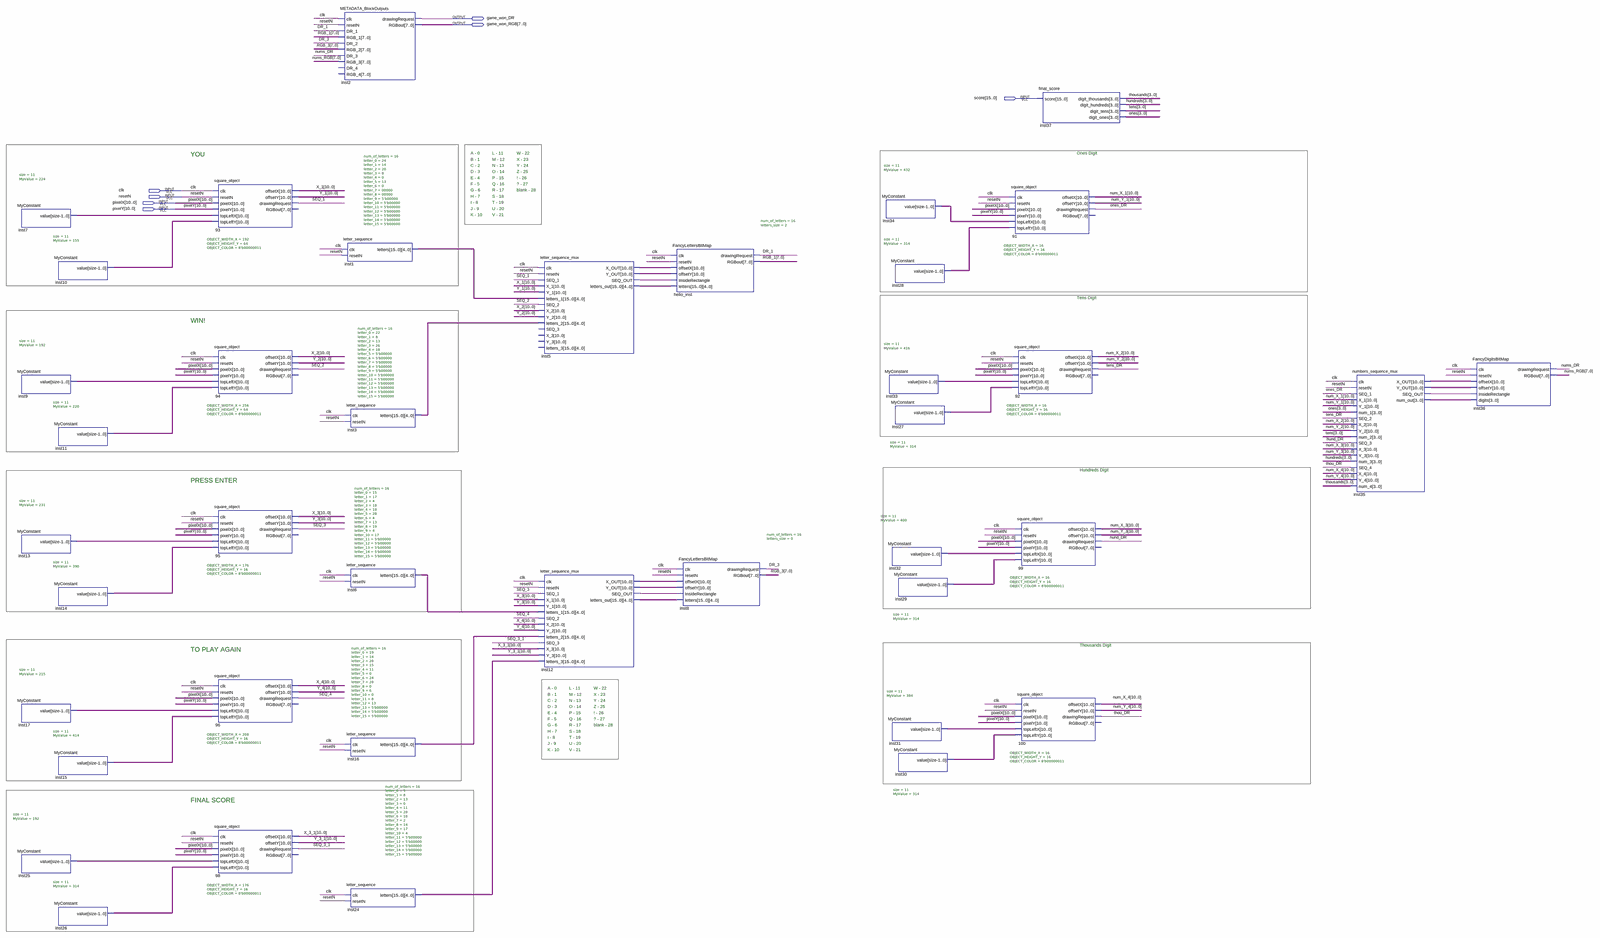
[diagram p0: schematic sheet, whole]
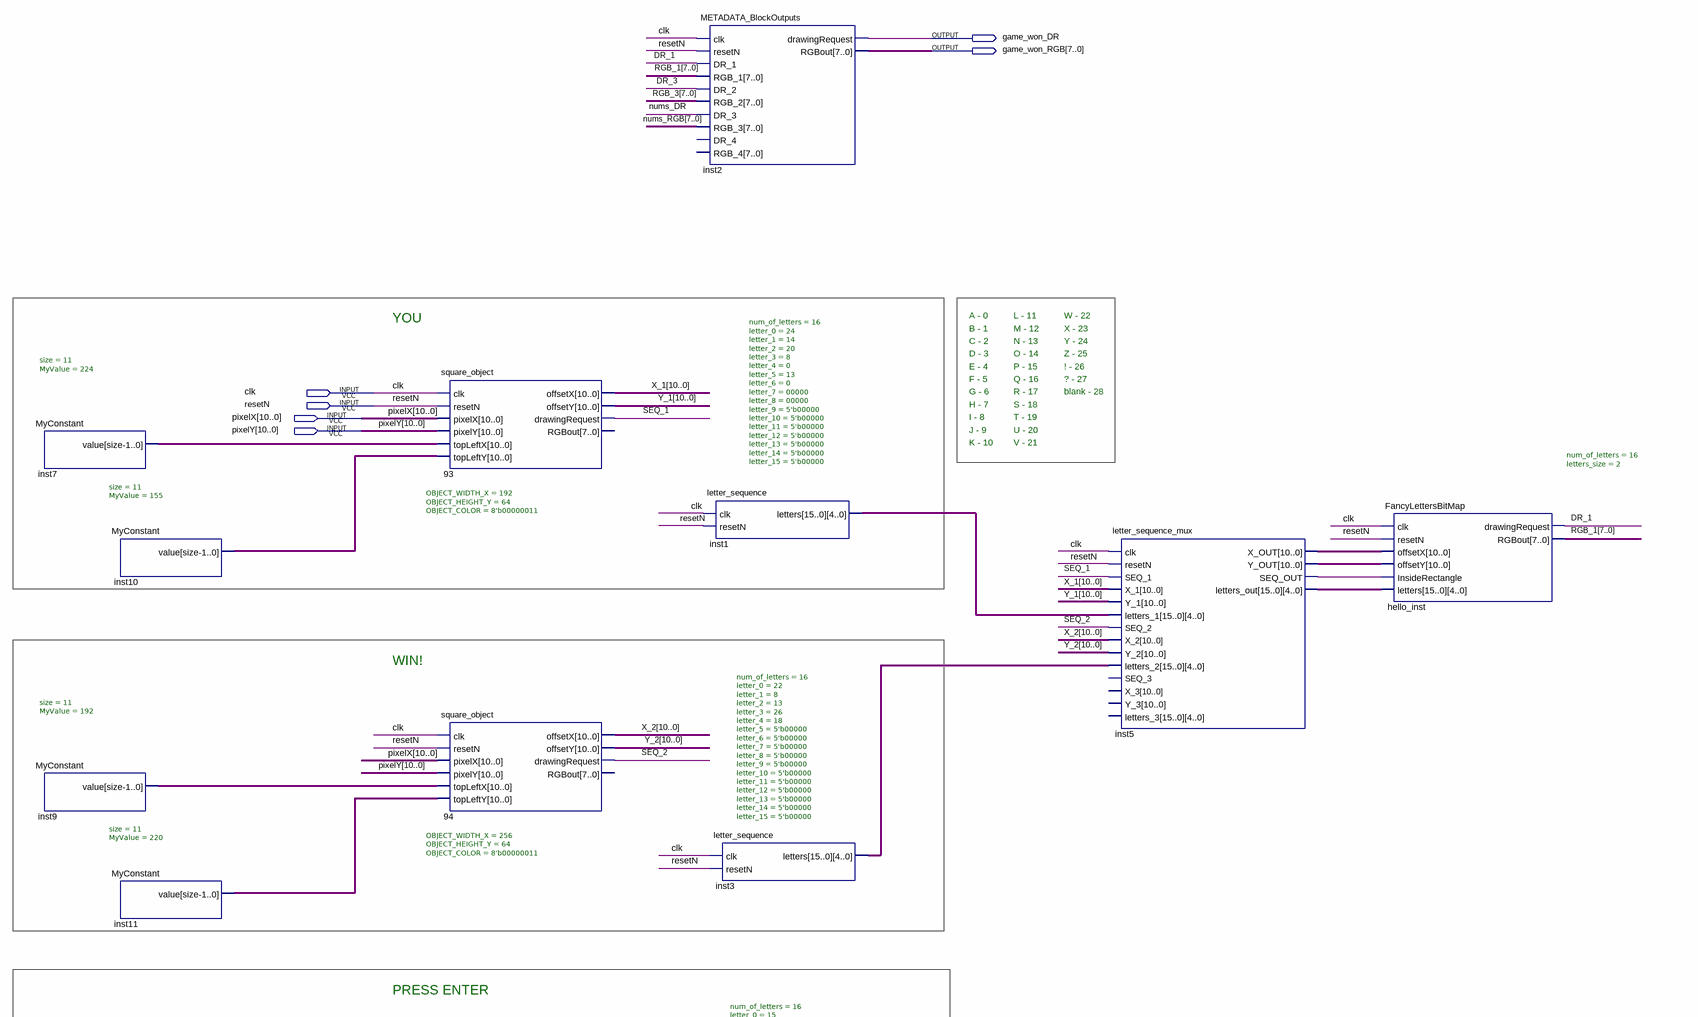
[diagram p1: schematic sheet, upper left part]
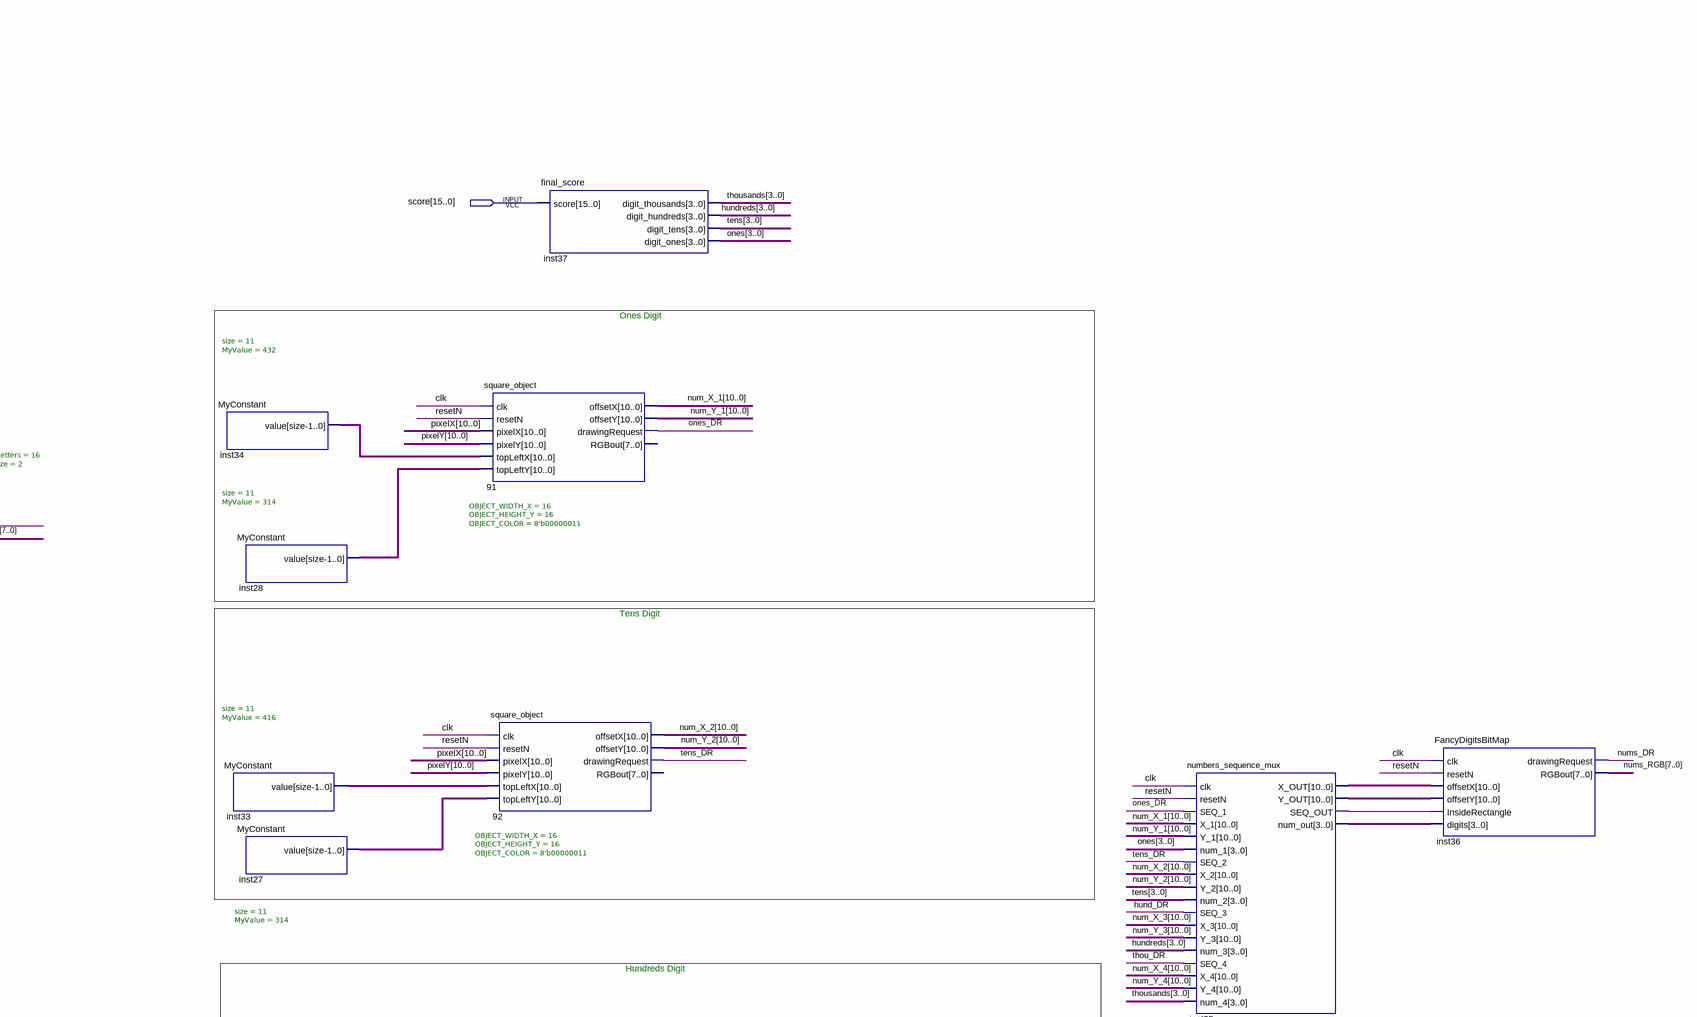
[diagram p2: schematic sheet, upper right part]
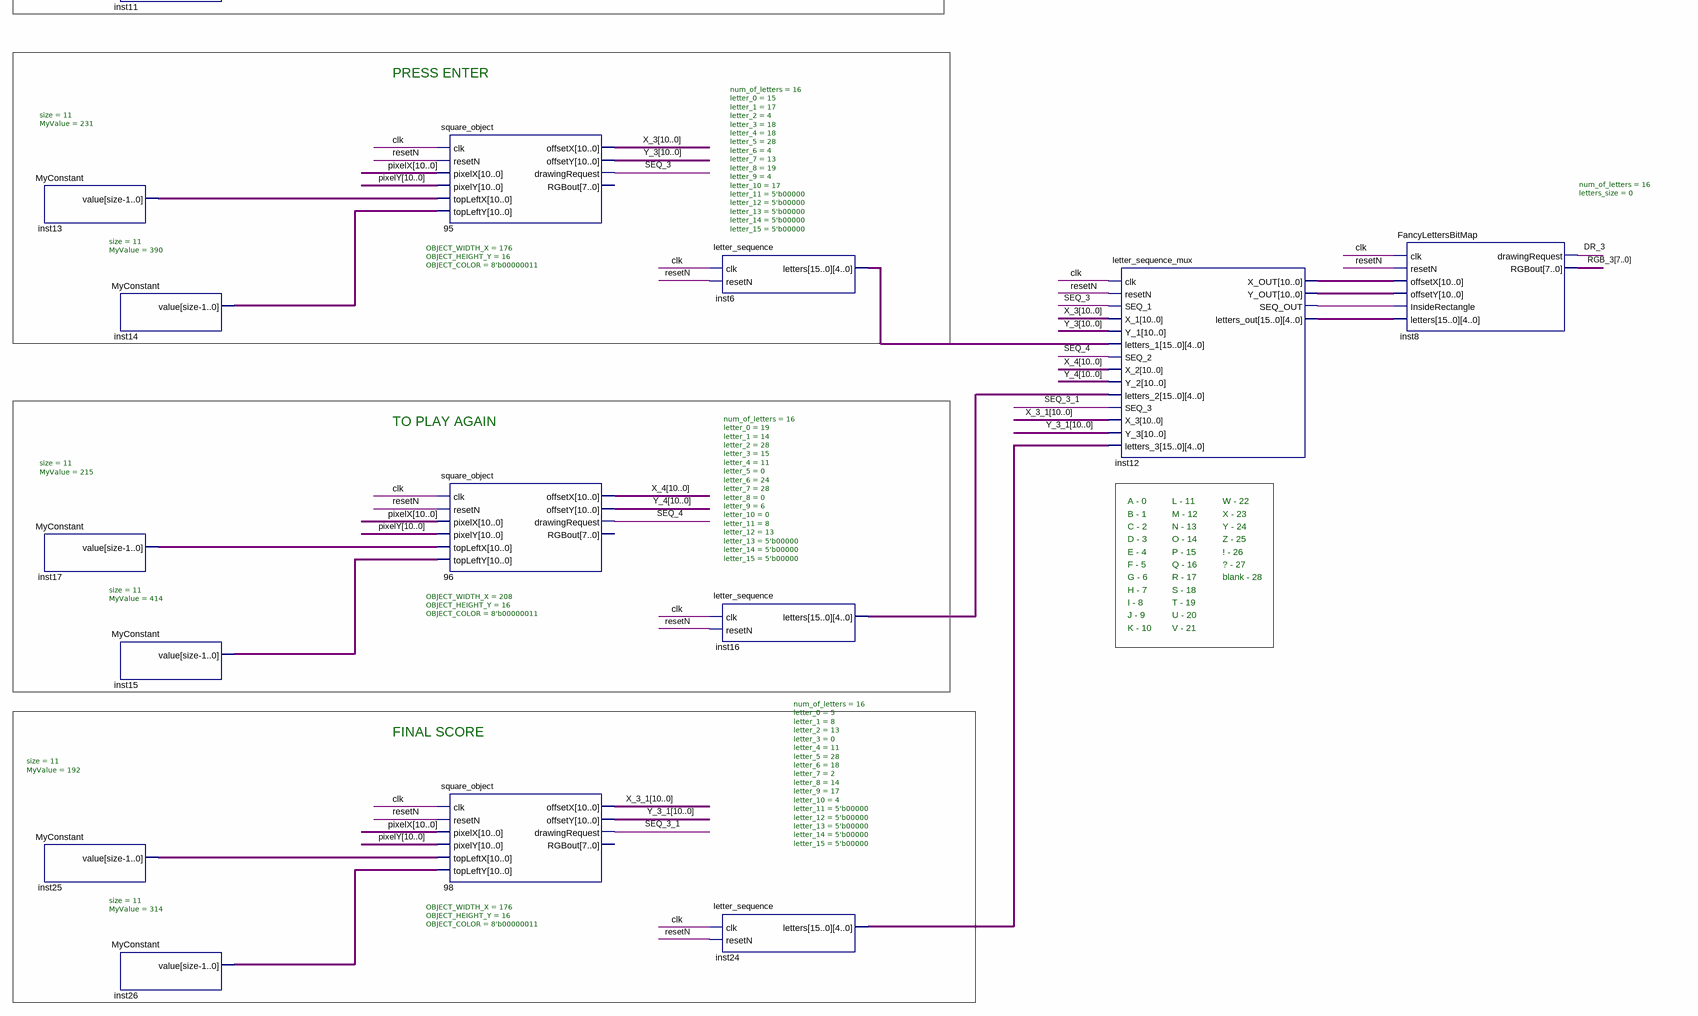
[diagram p3: schematic sheet, lower left part]
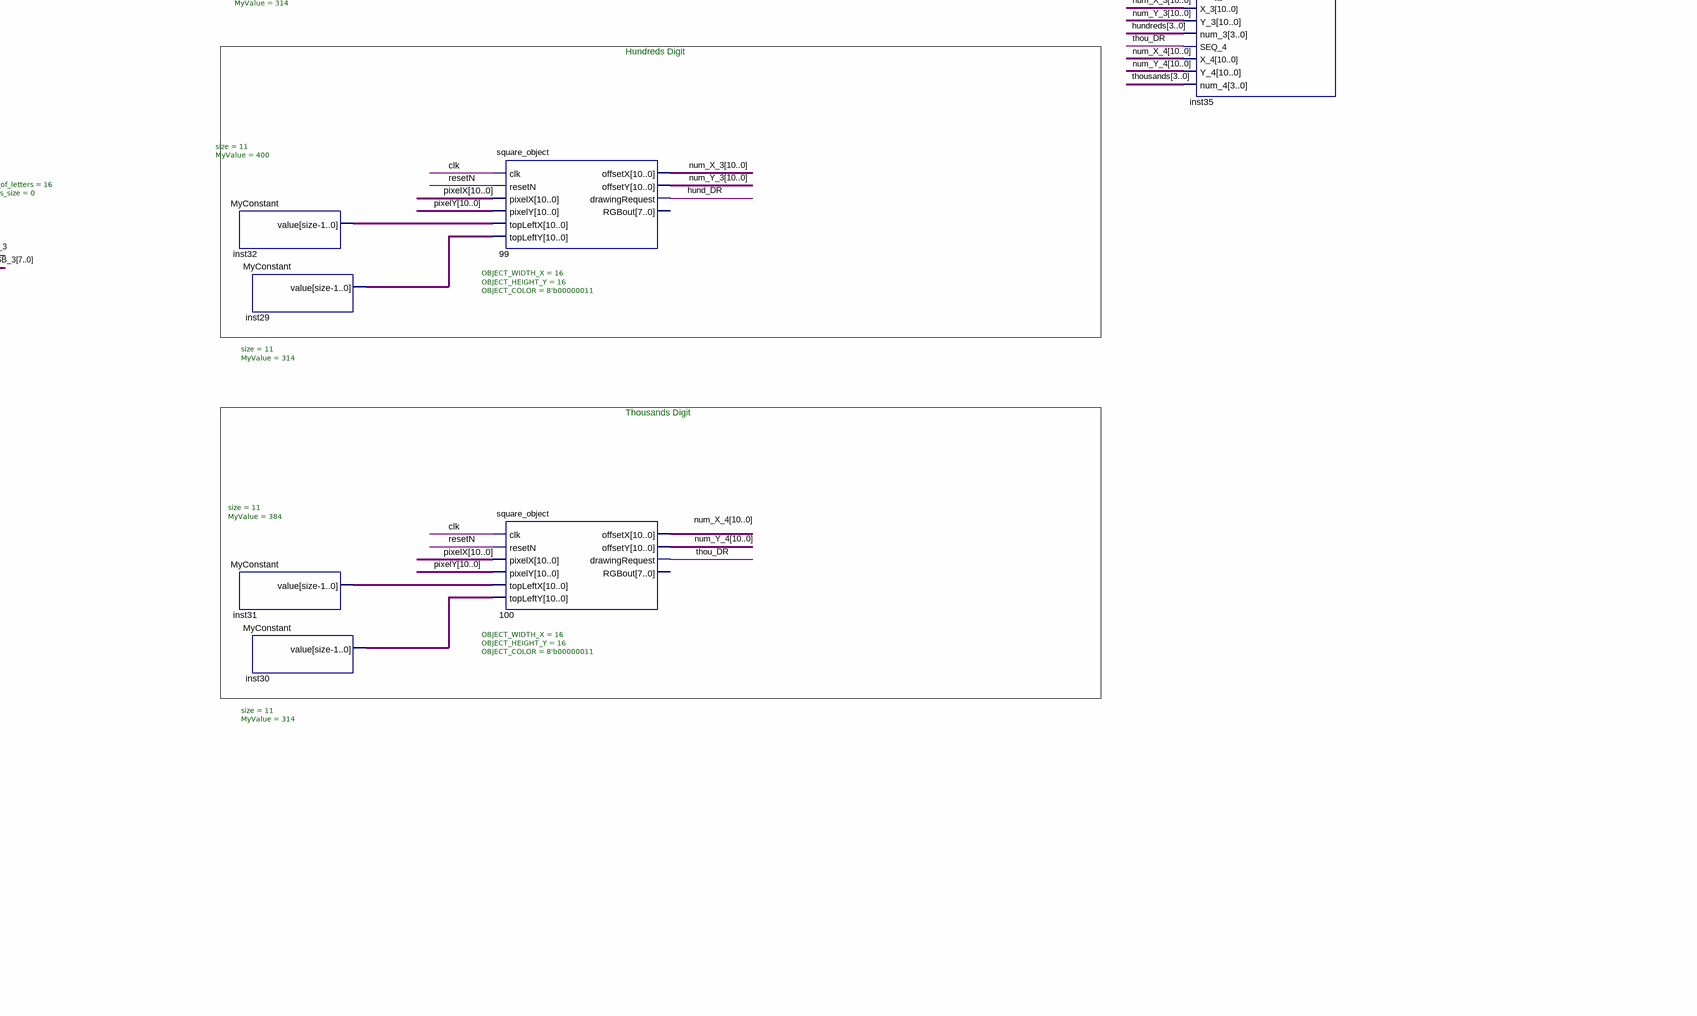
[diagram p4: schematic sheet, lower right part]
// Quartus schematic Game_Won_Screen_Block.bdf as structural Verilog: 40 symbols, 7 pins
module Game_Won_Screen_Block (
  input  [15:0] score,
  input  clk,
  input  resetN,
  input  [10:0] pixelX,
  input  [10:0] pixelY,
  output game_won_DR,
  output [7:0] game_won_RGB
);

  wire DR_1, DR_3, hund_DR, inst5_seq_out, inst12_seq_out, inst35_seq_out, nums_DR, ones_DR, SEQ_1, SEQ_2,
       SEQ_3, SEQ_3_1, SEQ_4, tens_DR, thou_DR;
  wire [3:0] hundreds, inst35_num_out, ones, tens, thousands;
  wire [7:0] nums_RGB, RGB_1, RGB_3;
  wire [10:0] inst5_x_out, inst5_y_out, inst7_value, inst9_value, inst10_value, inst11_value, inst12_x_out,
       inst12_y_out, inst13_value, inst14_value, inst15_value, inst17_value, inst25_value, inst26_value,
       inst27_value, inst28_value, inst29_value, inst30_value, inst31_value, inst32_value, inst33_value,
       inst34_value, inst35_x_out, inst35_y_out, num_X_1, num_X_2, num_X_3, num_X_4, num_Y_1, num_Y_2,
       num_Y_3, num_Y_4, X_1, X_2, X_3, X_3_1, X_4, Y_1, Y_2, Y_3, Y_3_1, Y_4;
  wire [79:0] inst1_letters, inst3_letters, inst5_letters_out, inst6_letters, inst12_letters_out,
       inst16_letters, inst24_letters;

  MyConstant #(.size(11), .MyValue(224)) inst7 (.value(inst7_value));
  MyConstant #(.size(11), .MyValue(192)) inst9 (.value(inst9_value));
  MyConstant #(.size(11), .MyValue(231)) inst13 (.value(inst13_value));
  MyConstant #(.size(11), .MyValue(215)) inst17 (.value(inst17_value));
  MyConstant #(.size(11), .MyValue(192)) inst25 (.value(inst25_value));
  MyConstant #(.size(11), .MyValue(155)) inst10 (.value(inst10_value));
  MyConstant #(.size(11), .MyValue(220)) inst11 (.value(inst11_value));
  MyConstant #(.size(11), .MyValue(390)) inst14 (.value(inst14_value));
  MyConstant #(.size(11), .MyValue(414)) inst15 (.value(inst15_value));
  MyConstant #(.size(11), .MyValue(314)) inst26 (.value(inst26_value));
  square_object #(.OBJECT_WIDTH_X(192), .OBJECT_HEIGHT_Y(64), .OBJECT_COLOR(8'b00000011)) u_93 (
    .clk(clk), .resetN(resetN), .pixelX(pixelX), .pixelY(pixelY), .topLeftX(inst7_value),
    .topLeftY(inst10_value), .offsetX(X_1), .offsetY(Y_1), .drawingRequest(SEQ_1));  // open: RGBout
  square_object #(.OBJECT_WIDTH_X(256), .OBJECT_HEIGHT_Y(64), .OBJECT_COLOR(8'b00000011)) u_94 (
    .clk(clk), .resetN(resetN), .pixelX(pixelX), .pixelY(pixelY), .topLeftX(inst9_value),
    .topLeftY(inst11_value), .offsetX(X_2), .offsetY(Y_2), .drawingRequest(SEQ_2));  // open: RGBout
  square_object #(.OBJECT_WIDTH_X(176), .OBJECT_HEIGHT_Y(16), .OBJECT_COLOR(8'b00000011)) u_95 (
    .clk(clk), .resetN(resetN), .pixelX(pixelX), .pixelY(pixelY), .topLeftX(inst13_value),
    .topLeftY(inst14_value), .offsetX(X_3), .offsetY(Y_3), .drawingRequest(SEQ_3));  // open: RGBout
  square_object #(.OBJECT_WIDTH_X(208), .OBJECT_HEIGHT_Y(16), .OBJECT_COLOR(8'b00000011)) u_96 (
    .clk(clk), .resetN(resetN), .pixelX(pixelX), .pixelY(pixelY), .topLeftX(inst17_value),
    .topLeftY(inst15_value), .offsetX(X_4), .offsetY(Y_4), .drawingRequest(SEQ_4));  // open: RGBout
  square_object #(.OBJECT_WIDTH_X(176), .OBJECT_HEIGHT_Y(16), .OBJECT_COLOR(8'b00000011)) u_98 (
    .clk(clk), .resetN(resetN), .pixelX(pixelX), .pixelY(pixelY), .topLeftX(inst25_value),
    .topLeftY(inst26_value), .offsetX(X_3_1), .offsetY(Y_3_1), .drawingRequest(SEQ_3_1));  // open: RGBout
  METADATA_BlockOutputs inst2 (
    .clk(clk), .resetN(resetN), .DR_1(DR_1), .RGB_1(RGB_1), .DR_2(DR_3), .RGB_2(RGB_3), .DR_3(nums_DR),
    .RGB_3(nums_RGB), .drawingRequest(game_won_DR), .RGBout(game_won_RGB));  // open: DR_4, RGB_4
  letter_sequence #(.num_of_letters(16), .letter_0(24), .letter_1(14), .letter_2(20), .letter_3(8), .letter_4(0), .letter_5(13), .letter_6(0), .letter_7(00000), .letter_8(00000), .letter_9(5'b00000), .letter_10(5'b00000), .letter_11(5'b00000), .letter_12(5'b00000), .letter_13(5'b00000), .letter_14(5'b00000), .letter_15(5'b00000)) inst1 (
    .clk(clk), .resetN(resetN), .letters(inst1_letters));
  letter_sequence #(.num_of_letters(16), .letter_0(22), .letter_1(8), .letter_2(13), .letter_3(26), .letter_4(18), .letter_5(5'b00000), .letter_6(5'b00000), .letter_7(5'b00000), .letter_8(5'b00000), .letter_9(5'b00000), .letter_10(5'b00000), .letter_11(5'b00000), .letter_12(5'b00000), .letter_13(5'b00000), .letter_14(5'b00000), .letter_15(5'b00000)) inst3 (
    .clk(clk), .resetN(resetN), .letters(inst3_letters));
  letter_sequence #(.num_of_letters(16), .letter_0(15), .letter_1(17), .letter_2(4), .letter_3(18), .letter_4(18), .letter_5(28), .letter_6(4), .letter_7(13), .letter_8(19), .letter_9(4), .letter_10(17), .letter_11(5'b00000), .letter_12(5'b00000), .letter_13(5'b00000), .letter_14(5'b00000), .letter_15(5'b00000)) inst6 (
    .clk(clk), .resetN(resetN), .letters(inst6_letters));
  letter_sequence #(.num_of_letters(16), .letter_0(19), .letter_1(14), .letter_2(28), .letter_3(15), .letter_4(11), .letter_5(0), .letter_6(24), .letter_7(28), .letter_8(0), .letter_9(6), .letter_10(0), .letter_11(8), .letter_12(13), .letter_13(5'b00000), .letter_14(5'b00000), .letter_15(5'b00000)) inst16 (
    .clk(clk), .resetN(resetN), .letters(inst16_letters));
  letter_sequence #(.num_of_letters(16), .letter_0(5), .letter_1(8), .letter_2(13), .letter_3(0), .letter_4(11), .letter_5(28), .letter_6(18), .letter_7(2), .letter_8(14), .letter_9(17), .letter_10(4), .letter_11(5'b00000), .letter_12(5'b00000), .letter_13(5'b00000), .letter_14(5'b00000), .letter_15(5'b00000)) inst24 (
    .clk(clk), .resetN(resetN), .letters(inst24_letters));
  letter_sequence_mux inst5 (
    .clk(clk), .resetN(resetN), .SEQ_1(SEQ_1), .X_1(X_1), .Y_1(Y_1), .letters_1(inst1_letters),
    .SEQ_2(SEQ_2), .X_2(X_2), .Y_2(Y_2), .letters_2(inst3_letters), .X_OUT(inst5_x_out), .Y_OUT(inst5_y_out),
    .SEQ_OUT(inst5_seq_out), .letters_out(inst5_letters_out));  // open: SEQ_3, X_3, Y_3, letters_3
  letter_sequence_mux inst12 (
    .clk(clk), .resetN(resetN), .SEQ_1(SEQ_3), .X_1(X_3), .Y_1(Y_3), .letters_1(inst6_letters),
    .SEQ_2(SEQ_4), .X_2(X_4), .Y_2(Y_4), .letters_2(inst16_letters), .SEQ_3(SEQ_3_1), .X_3(X_3_1),
    .Y_3(Y_3_1), .letters_3(inst24_letters), .X_OUT(inst12_x_out), .Y_OUT(inst12_y_out),
    .SEQ_OUT(inst12_seq_out), .letters_out(inst12_letters_out));
  FancyLettersBitMap #(.num_of_letters(16), .letters_size(2)) hello_inst (
    .clk(clk), .resetN(resetN), .offsetX(inst5_x_out), .offsetY(inst5_y_out),
    .InsideRectangle(inst5_seq_out), .letters(inst5_letters_out), .drawingRequest(DR_1), .RGBout(RGB_1));
  FancyLettersBitMap #(.num_of_letters(16), .letters_size(0)) inst8 (
    .clk(clk), .resetN(resetN), .offsetX(inst12_x_out), .offsetY(inst12_y_out),
    .InsideRectangle(inst12_seq_out), .letters(inst12_letters_out), .drawingRequest(DR_3), .RGBout(RGB_3));
  MyConstant #(.size(11), .MyValue(432)) inst34 (.value(inst34_value));
  MyConstant #(.size(11), .MyValue(314)) inst28 (.value(inst28_value));
  MyConstant #(.size(11), .MyValue(416)) inst33 (.value(inst33_value));
  MyConstant #(.size(11), .MyValue(314)) inst27 (.value(inst27_value));
  MyConstant #(.size(11), .MyValue(400)) inst32 (.value(inst32_value));
  MyConstant #(.size(11), .MyValue(314)) inst29 (.value(inst29_value));
  MyConstant #(.size(11), .MyValue(384)) inst31 (.value(inst31_value));
  MyConstant #(.size(11), .MyValue(314)) inst30 (.value(inst30_value));
  square_object #(.OBJECT_WIDTH_X(16), .OBJECT_HEIGHT_Y(16), .OBJECT_COLOR(8'b00000011)) u_91 (
    .clk(clk), .resetN(resetN), .pixelX(pixelX), .pixelY(pixelY), .topLeftX(inst34_value),
    .topLeftY(inst28_value), .offsetX(num_X_1), .offsetY(num_Y_1), .drawingRequest(ones_DR));  // open: RGBout
  square_object #(.OBJECT_WIDTH_X(16), .OBJECT_HEIGHT_Y(16), .OBJECT_COLOR(8'b00000011)) u_92 (
    .clk(clk), .resetN(resetN), .pixelX(pixelX), .pixelY(pixelY), .topLeftX(inst33_value),
    .topLeftY(inst27_value), .offsetX(num_X_2), .offsetY(num_Y_2), .drawingRequest(tens_DR));  // open: RGBout
  square_object #(.OBJECT_WIDTH_X(16), .OBJECT_HEIGHT_Y(16), .OBJECT_COLOR(8'b00000011)) u_99 (
    .clk(clk), .resetN(resetN), .pixelX(pixelX), .pixelY(pixelY), .topLeftX(inst32_value),
    .topLeftY(inst29_value), .offsetX(num_X_3), .offsetY(num_Y_3), .drawingRequest(hund_DR));  // open: RGBout
  square_object #(.OBJECT_WIDTH_X(16), .OBJECT_HEIGHT_Y(16), .OBJECT_COLOR(8'b00000011)) u_100 (
    .clk(clk), .resetN(resetN), .pixelX(pixelX), .pixelY(pixelY), .topLeftX(inst31_value),
    .topLeftY(inst30_value), .offsetX(num_X_4), .offsetY(num_Y_4), .drawingRequest(thou_DR));  // open: RGBout
  final_score inst37 (
    .score(score), .digit_thousands(thousands), .digit_hundreds(hundreds), .digit_tens(tens),
    .digit_ones(ones));
  numbers_sequence_mux inst35 (
    .clk(clk), .resetN(resetN), .SEQ_1(ones_DR), .X_1(num_X_1), .Y_1(num_Y_1), .num_1(ones), .SEQ_2(tens_DR),
    .X_2(num_X_2), .Y_2(num_Y_2), .num_2(tens), .SEQ_3(hund_DR), .X_3(num_X_3), .Y_3(num_Y_3),
    .num_3(hundreds), .SEQ_4(thou_DR), .X_4(num_X_4), .Y_4(num_Y_4), .num_4(thousands), .X_OUT(inst35_x_out),
    .Y_OUT(inst35_y_out), .SEQ_OUT(inst35_seq_out), .num_out(inst35_num_out));
  FancyDigitsBitMap inst36 (
    .clk(clk), .resetN(resetN), .offsetX(inst35_x_out), .offsetY(inst35_y_out),
    .InsideRectangle(inst35_seq_out), .digits(inst35_num_out), .drawingRequest(nums_DR), .RGBout(nums_RGB));

  // Notes on the sheet:
  //   YOU
  //   A - 0
  //   L - 11
  //   W - 22
  //   Ones Digit 
  //   B - 1
  //   M - 12
  //   X - 23
  //   C - 2
  //   N - 13
  //   Y - 24
  //   D - 3
  //   O - 14
  //   Z - 25
  //   E - 4
  //   P - 15
  //   ! - 26
  //   F - 5
  //   Q - 16
  //   ? - 27
  //   G - 6
  //   R - 17
  //   blank - 28
  //   H - 7
  //   S - 18
  //   I - 8
  //   T - 19
  //   J - 9
  //   U - 20
  //   K - 10
  //   V - 21
  //   Tens Digit 
  //   WIN!
  //   Hundreds Digit 
  //   PRESS ENTER
  //   Thousands Digit 
  //   TO PLAY AGAIN
  //   A - 0
  //   L - 11
  //   W - 22
  //   B - 1
  //   M - 12
  //   X - 23
  //   C - 2
  //   N - 13
  //   Y - 24
  //   D - 3
  //   O - 14
  //   Z - 25
  //   E - 4
  //   P - 15
  //   ! - 26
  //   F - 5
  //   Q - 16
  //   ? - 27
  //   G - 6
  //   R - 17
  //   blank - 28
  //   H - 7
  //   S - 18
  //   I - 8
  //   T - 19
  //   J - 9
  //   U - 20
  //   K - 10
  //   V - 21
  //   FINAL SCORE
endmodule
